# Altium project PCB_Project2.PrjPCB
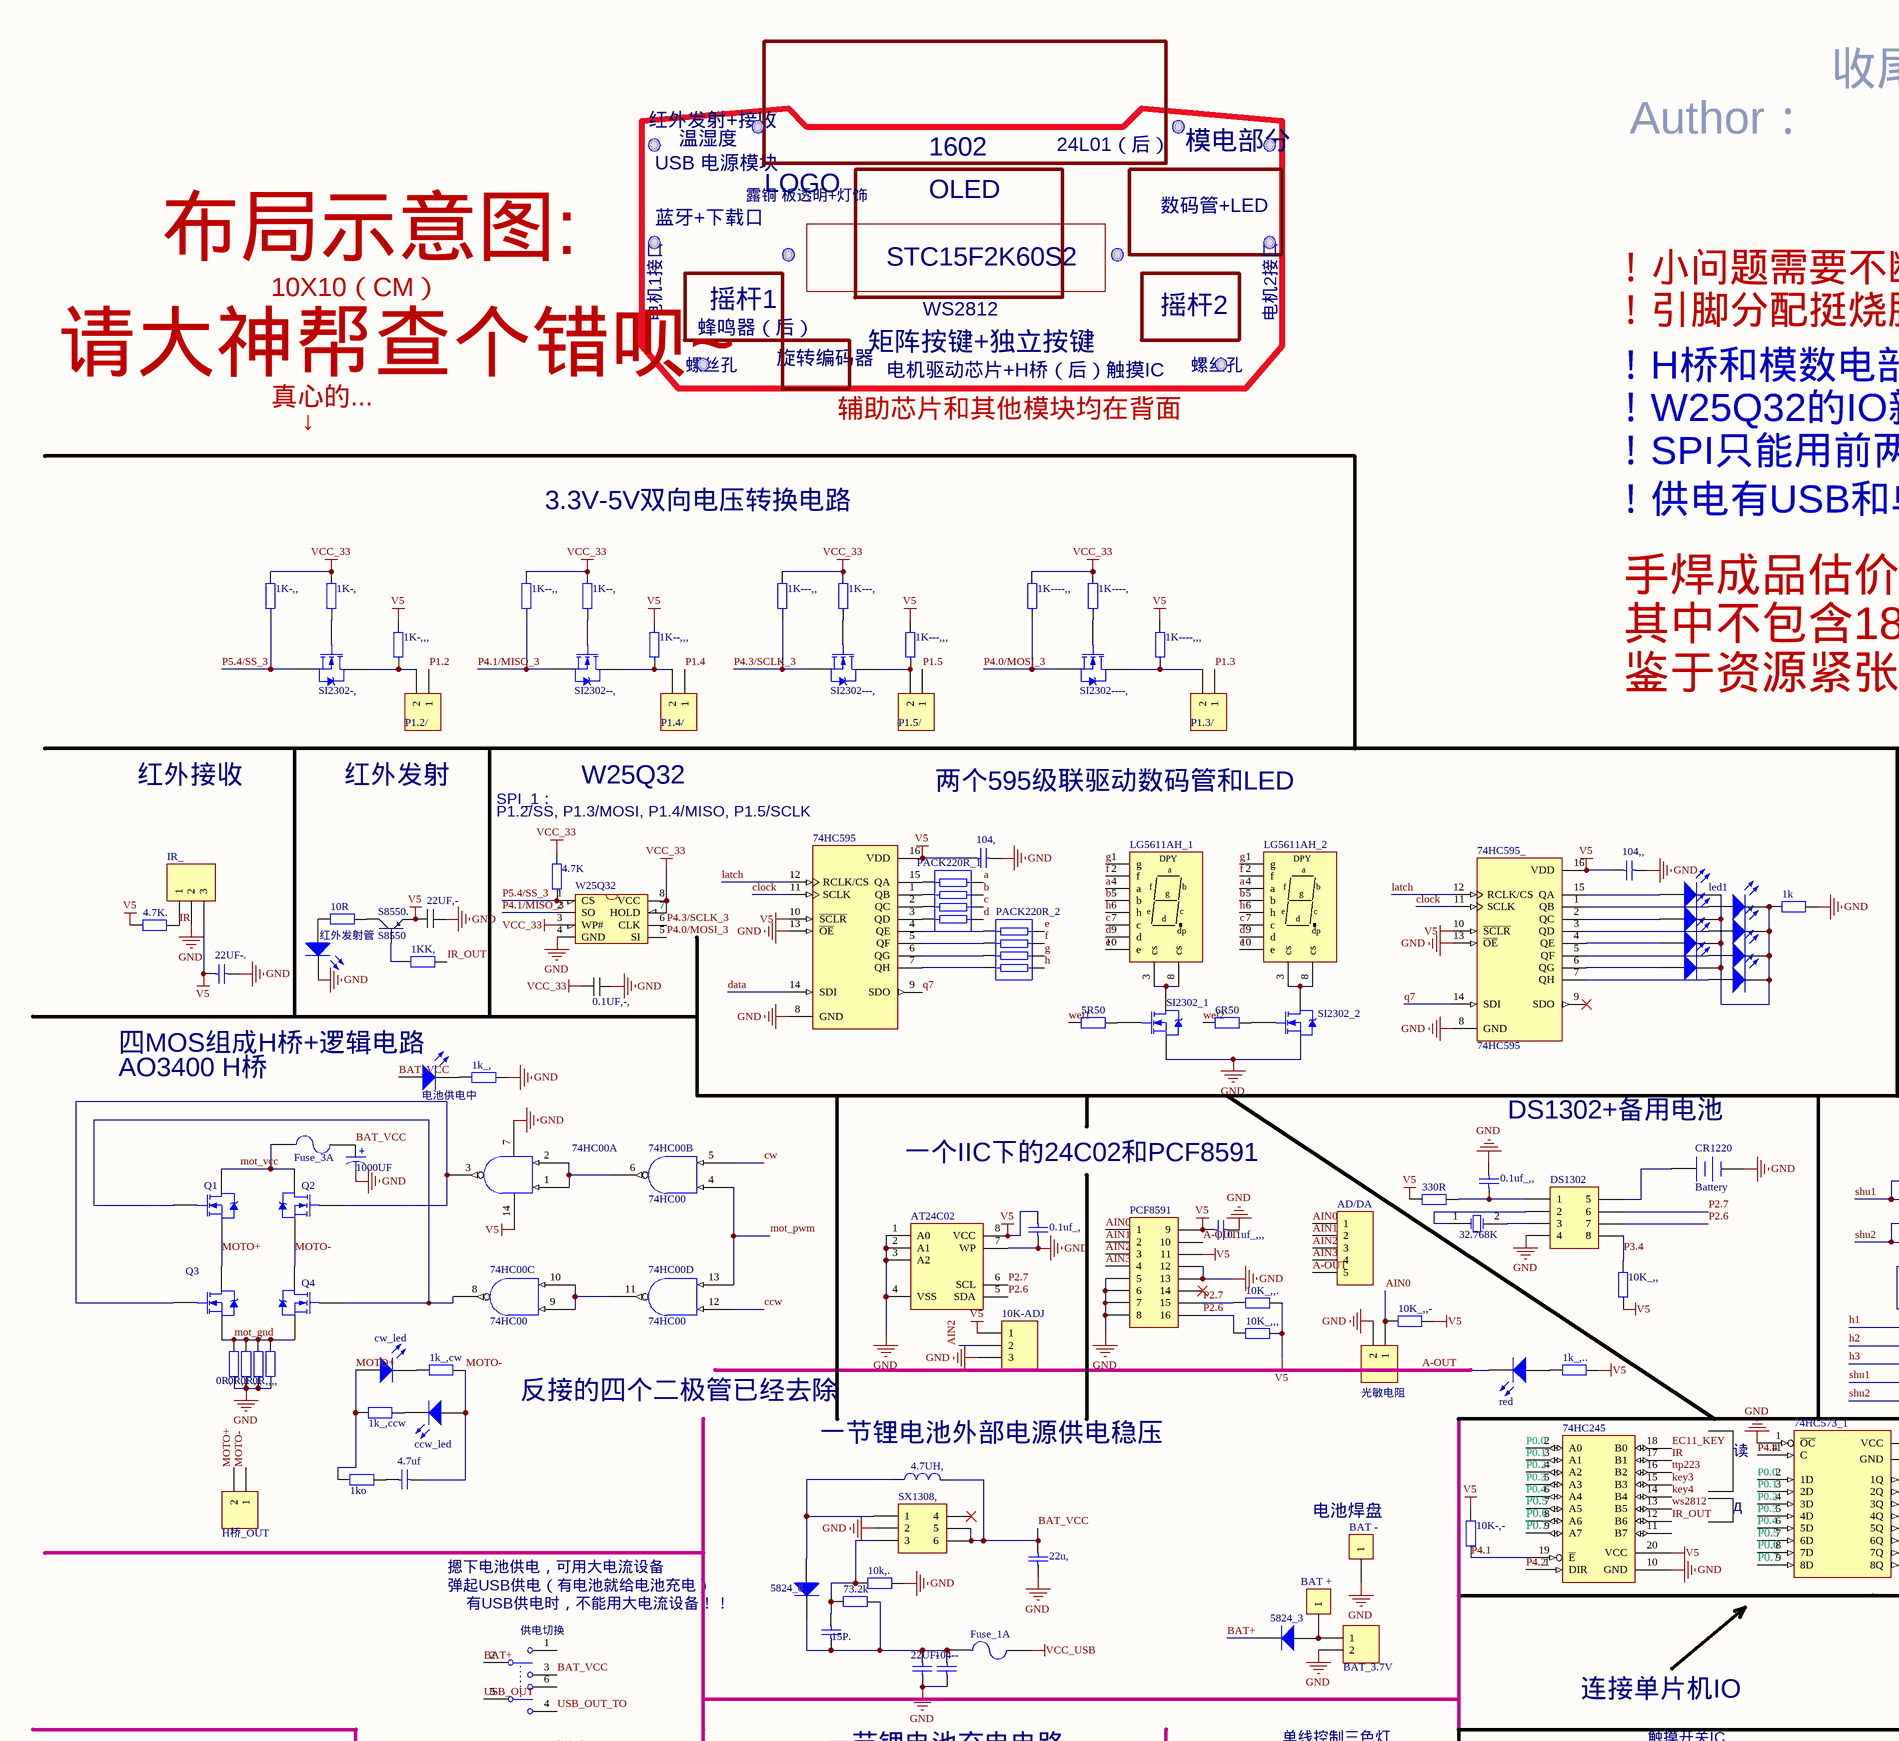
[diagram p0: Sheet1.SchDoc, top left]
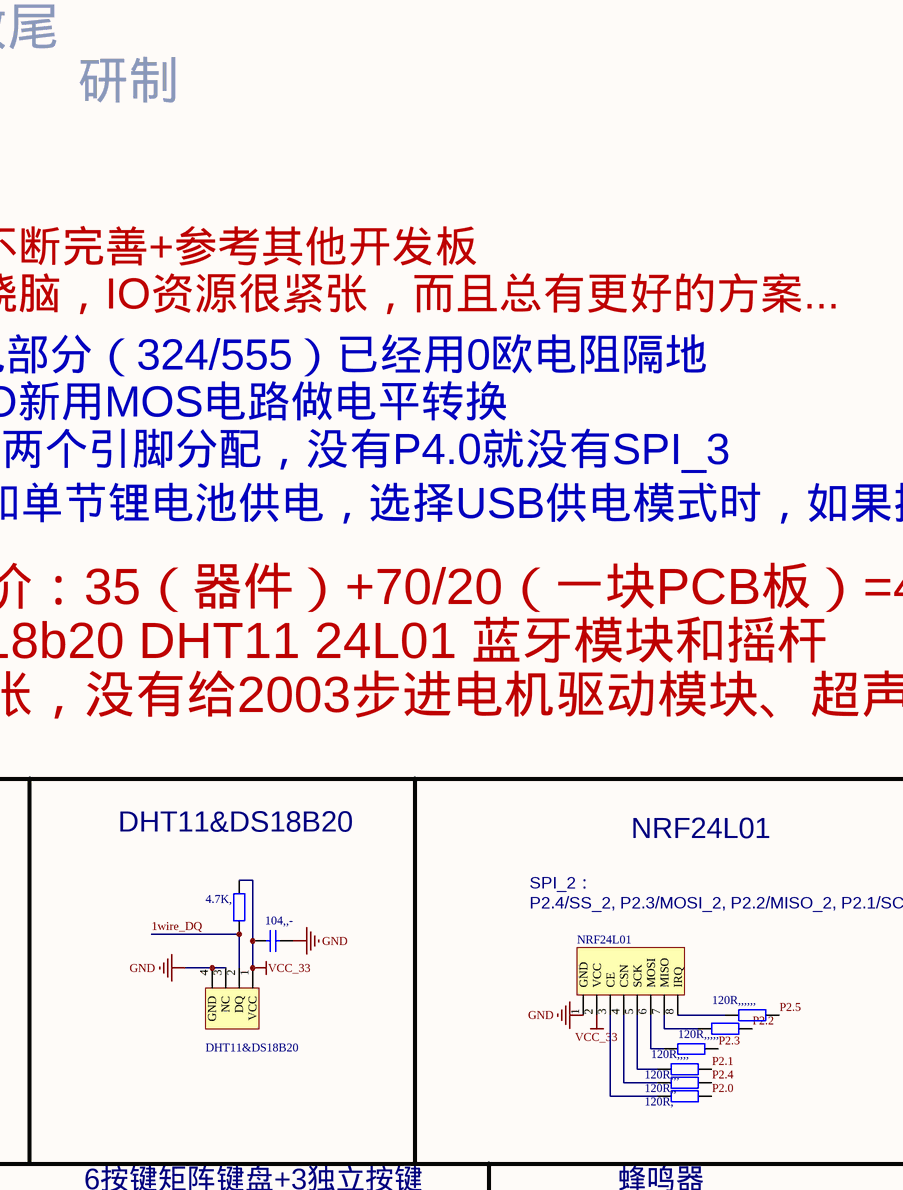
[diagram p1: Sheet1.SchDoc, top middle]
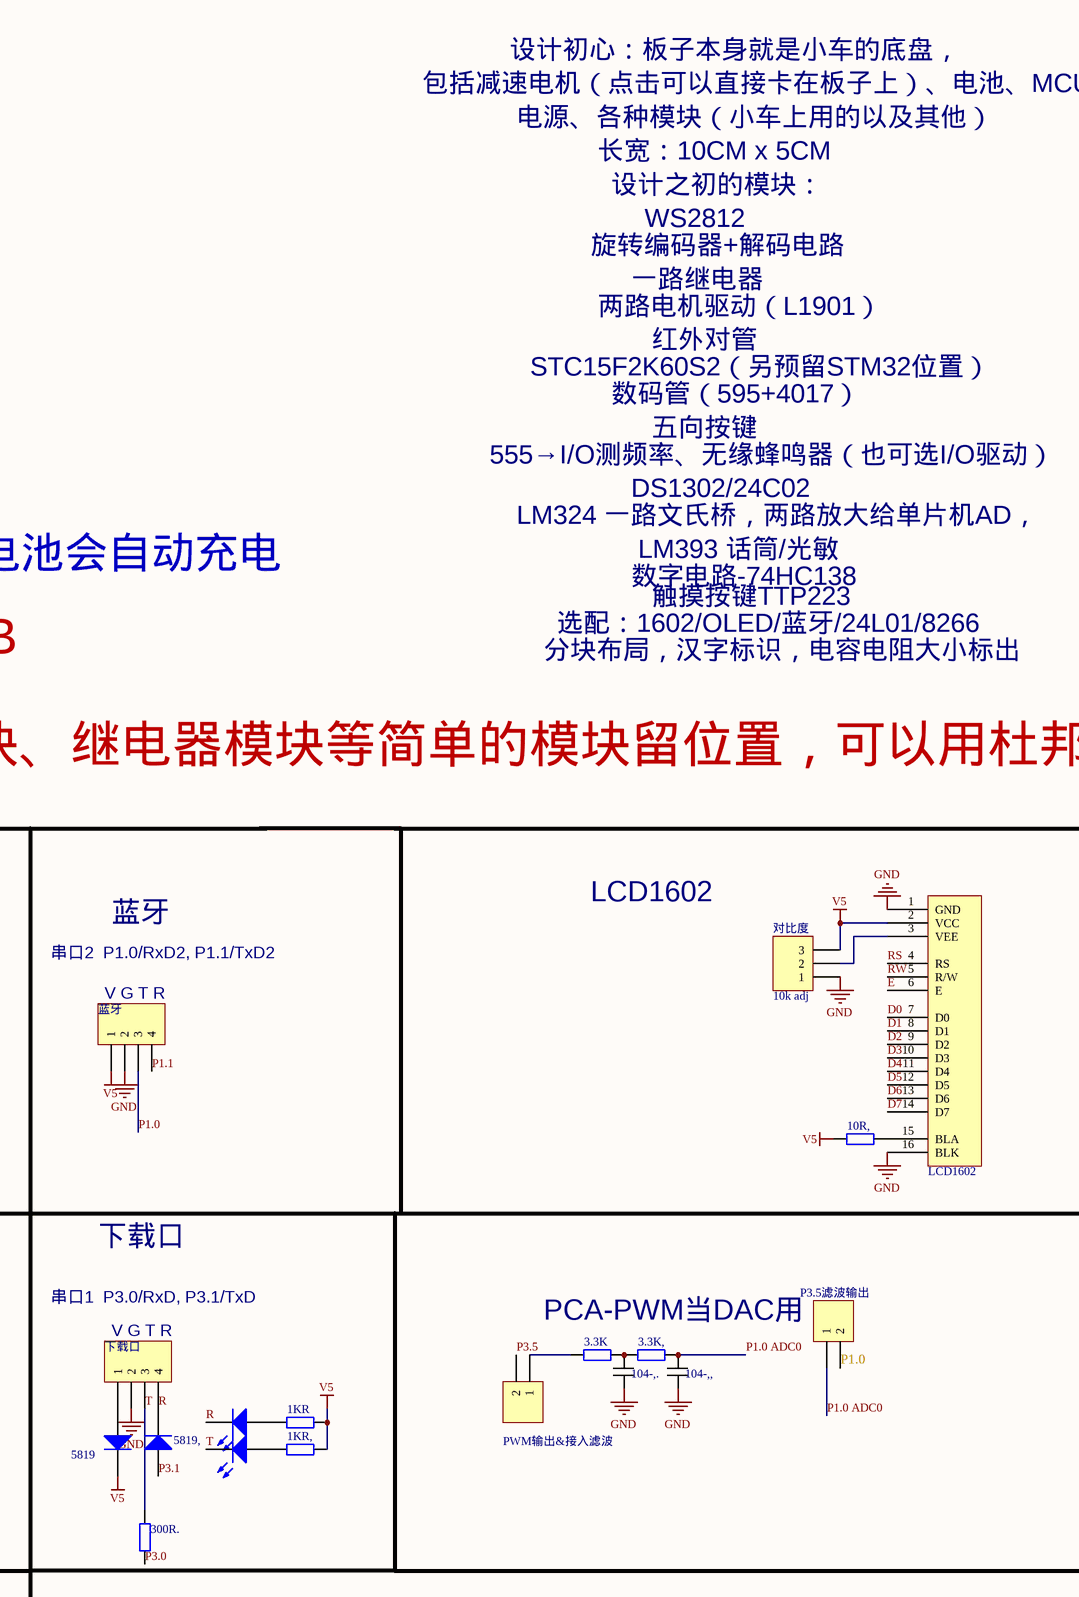
[diagram p2: Sheet1.SchDoc, top right]
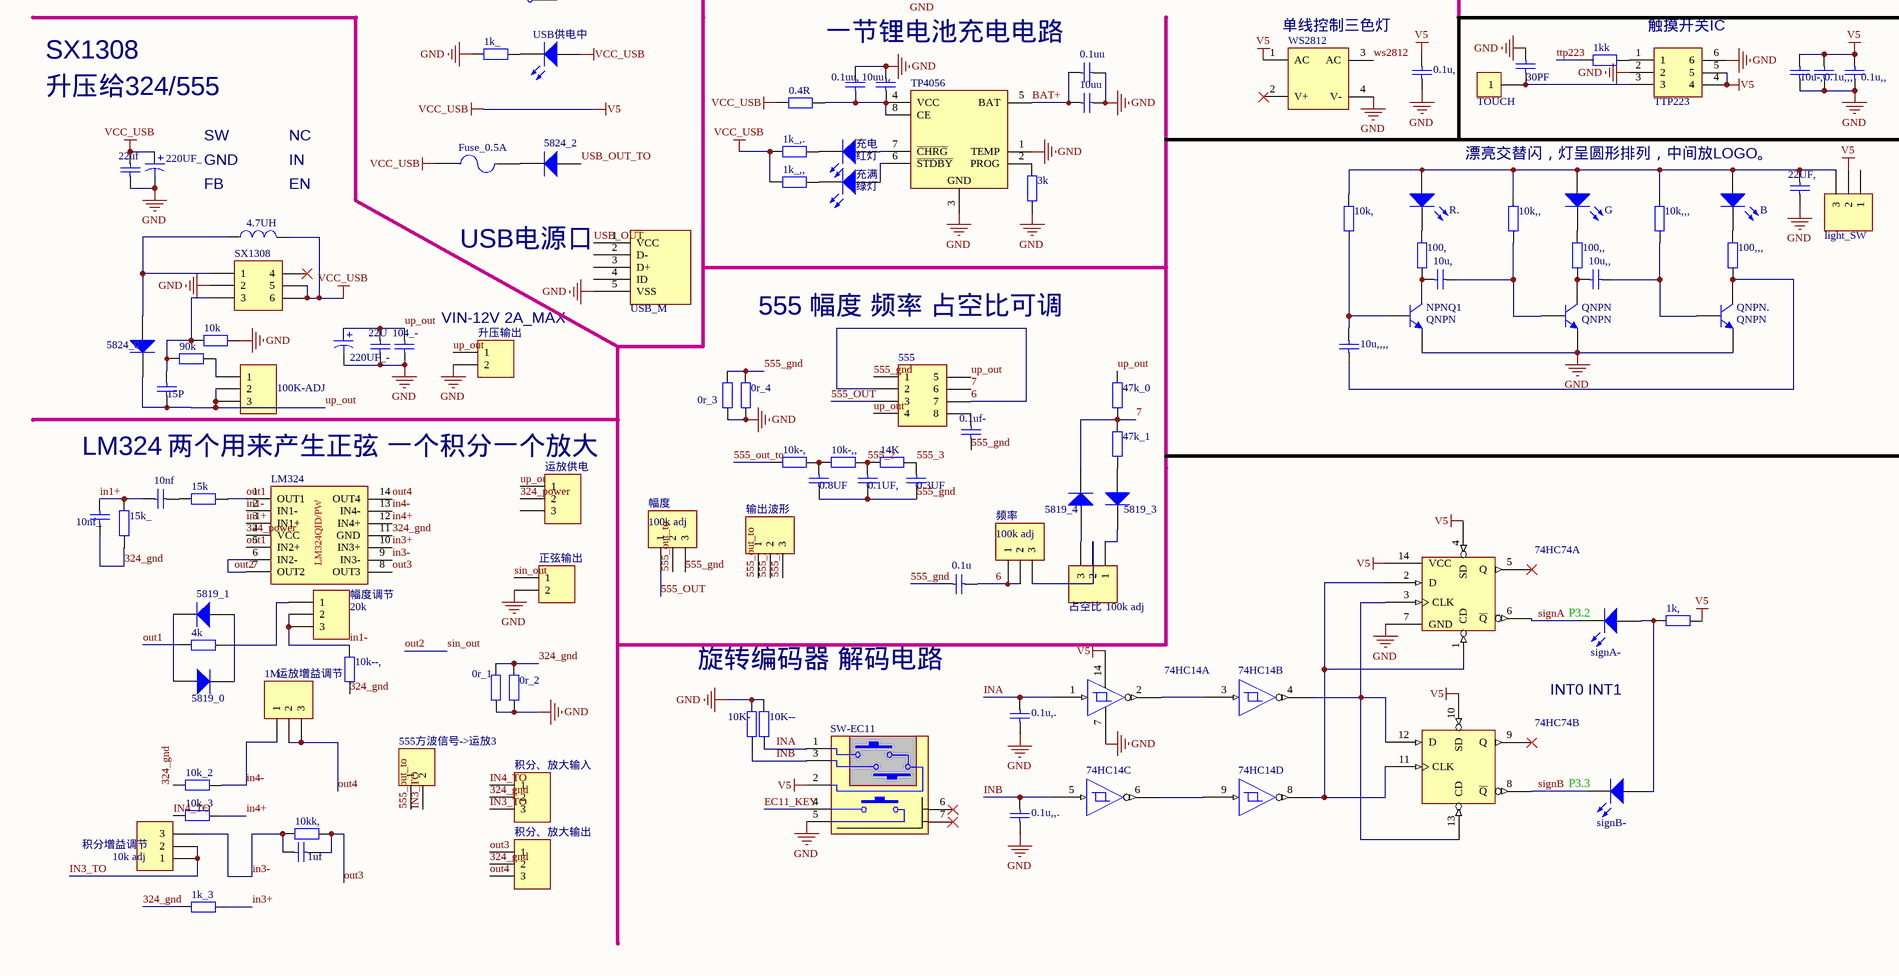
[diagram p3: Sheet1.SchDoc, bottom left]
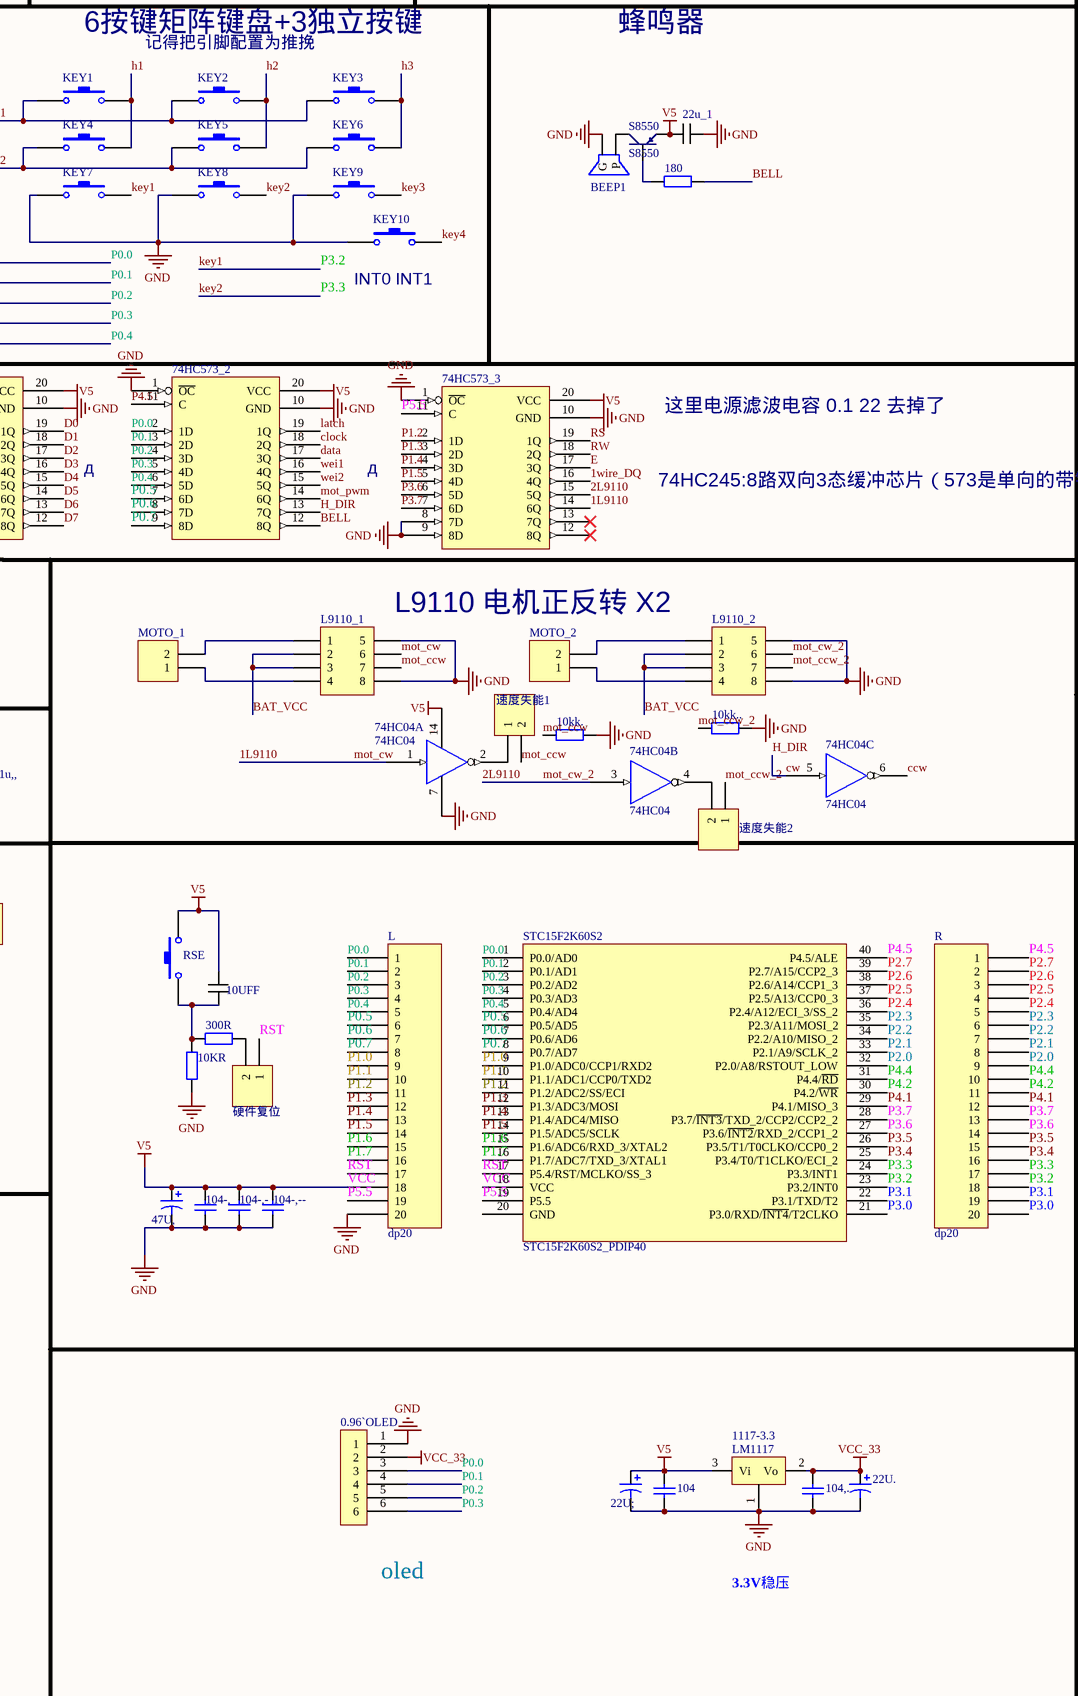
[diagram p4: Sheet1.SchDoc, bottom middle]
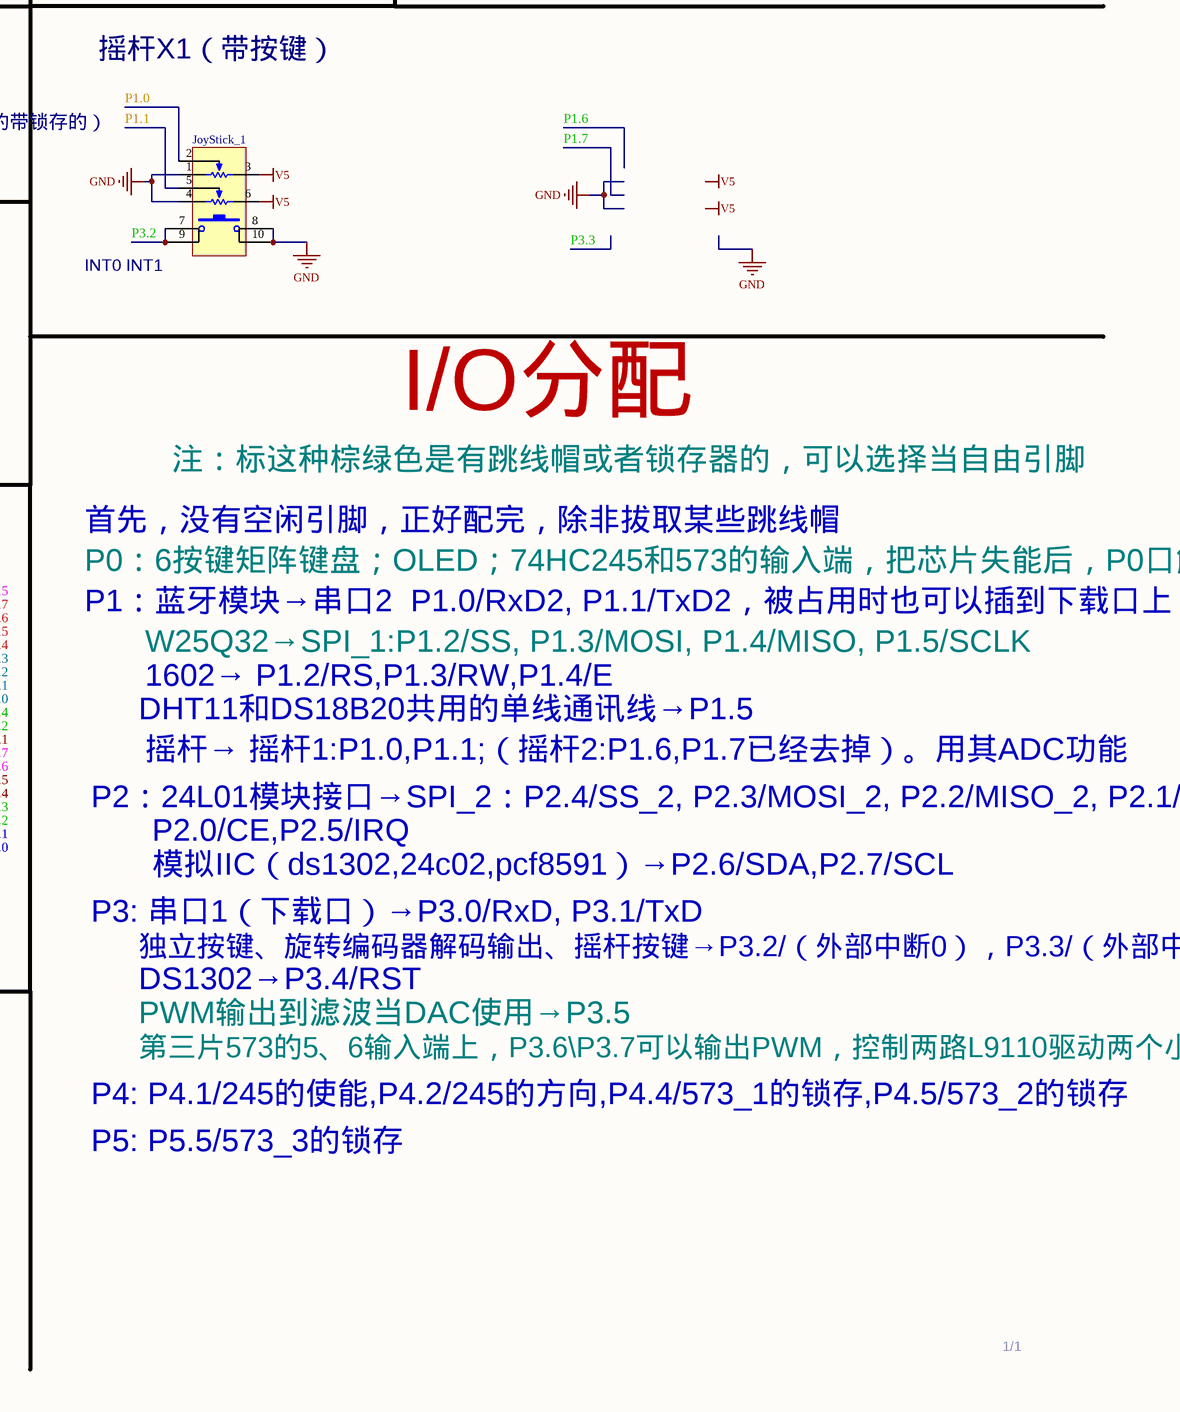
[diagram p5: Sheet1.SchDoc, bottom right]
1 sheet, 288 parts. Net scope: global (net labels, ports and power ports of the same name join across sheets).
Board file: PCB1.PcbDoc

## Sheet Sheet1.SchDoc: STC15开发板（寓教于乐多功能游戏把）
size A1; Author: @Staok; DrawnBy: 许皓阳; Revision: 3.14

### Parts
0  LED0  [LED_0805]  (value not drawn)
0.1u  Cap  [0805_C]  (value not drawn)
0.1u,  11  [C-RAD-0805]  (value not drawn)
0.1u,,  11  [C-RAD-0805]  (value not drawn)
0.1u,,,  11  [C-RAD-0805]  (value not drawn)
0.1u,,.  Cap  [0805_C]  (value not drawn)
0.1u,.  Cap  [0805_C]  (value not drawn)
0.1UF,  Cap  [0805_C]  (value not drawn)
0.1UF,-,  (no value)  [0805 - duplicate]
0.1uf-  Cap  [0805_C]  (value not drawn)
0.1uf_,  Cap  [0805_C]  (value not drawn)
0.1uf_,,  Cap  [0805_C]  (value not drawn)
0.1uf_,,,  Cap  [0805_C]  (value not drawn)
0.1uu  Cap  [0805_C]  (value not drawn)
0.1uu,  Cap  [0805_C]  (value not drawn)
0.3UF  Cap  [0805_C]  (value not drawn)
0.4R  Res2  [RES 0805_1]  (value not drawn)
0.8UF  Cap  [0805_C]  (value not drawn)
0.96`OLED  S6  [HDR1X6]  (value not drawn)
0R,  Res2  [0805-1]  (value not drawn)
0R,,  Res2  [0805-1]  (value not drawn)
0R,,,  Res2  [0805-1]  (value not drawn)
0R,,,,  Res2  [0805-1]  (value not drawn)
0r_1  Res2  [RES 0805_1]  (value not drawn)
0r_2  Res2  [RES 0805_1]  (value not drawn)
0r_3  Res2  [RES 0805_1]  (value not drawn)
0r_4  Res2  [RES 0805_1]  (value not drawn)
1  LED0  [LED_0805]  (value not drawn)
1k  Res1  [0805-2]  (value not drawn)
1k,  Res2  [RES 0805_1]  (value not drawn)
1K-,  Res2  [0805 - duplicate]  (value not drawn)
1K-,,  Res2  [0805 - duplicate]  (value not drawn)
1K-,,,  Res2  [0805 - duplicate]  (value not drawn)
1K--,  Res2  [0805 - duplicate]  (value not drawn)
1K--,,  Res2  [0805 - duplicate]  (value not drawn)
1K--,,,  Res2  [0805 - duplicate]  (value not drawn)
1K---,  Res2  [0805 - duplicate]  (value not drawn)
1K---,,  Res2  [0805 - duplicate]  (value not drawn)
1K---,,,  Res2  [0805 - duplicate]  (value not drawn)
1K----,  Res2  [0805 - duplicate]  (value not drawn)
1K----,,  Res2  [0805 - duplicate]  (value not drawn)
1K----,,,  Res2  [0805 - duplicate]  (value not drawn)
1k_  Res2  [0805-1]  (value not drawn)
1k_3  Res2  [RES 0805_1]  (value not drawn)
1k_,  Res2  [0805-1]  (value not drawn)
1k_,,  Res2  [0805-1]  (value not drawn)
1k_,.  Res2  [0805-1]  (value not drawn)
1k_,..  R2  [0805]  (value not drawn)
1k_,ccw  Res2  [0805-1]  (value not drawn)
1k_,cw  Res2  [0805-1]  (value not drawn)
1kk  Res2  [RES 0805_1]  (value not drawn)
1KK,  Res2  [0805 - duplicate]  (value not drawn)
1ko  Res2  [0805-1]  (value not drawn)
1KR  Res2  [0805 - duplicate]  (value not drawn)
1KR,  Res2  [0805 - duplicate]  (value not drawn)
1uf  Cap  [0805_C]  (value not drawn)
3.3K  Res2  [0805 - duplicate]  (value not drawn)
3.3K,  Res2  [0805 - duplicate]  (value not drawn)
3k  Res2  [RES 0805_1]  (value not drawn)
4.7K  Res2  [0805 - duplicate]  (value not drawn)
4.7K,  Res1  [0805-2]  (value not drawn)
4.7K.  Res2  [0805-1]  (value not drawn)
4.7uf  Cap  [0805_C]  (value not drawn)
4.7UH  Inductor  [L-SMD-10]  (value not drawn)
4.7UH,  Inductor  [L-SMD-10]  (value not drawn)
4k  Res2  [RES 0805_1]  (value not drawn)
5R50  R2  [0805]  (value not drawn)
6R50  R2  [0805]  (value not drawn)
10k  Res2  [RES 0805_1]  (value not drawn)
10k,  Res2  [RES 0805_1]  (value not drawn)
10k,,  Res2  [RES 0805_1]  (value not drawn)
10k,,,  Res2  [RES 0805_1]  (value not drawn)
10k,.  Res2  [RES 0805_1]  (value not drawn)
10K-  Res2  [RES 0805_1]  (value not drawn)
10k-,  Res2  [RES 0805_1]  (value not drawn)
10k-,,  Res2  [RES 0805_1]  (value not drawn)
10K-,-  R2  [0805]  (value not drawn)
10K--  Res2  [RES 0805_1]  (value not drawn)
10k--,  Res2  [RES 0805_1]  (value not drawn)
10K-ADJ  MHDR1X3  [pot（正方形）]  (value not drawn)
10k_2  Res2  [RES 0805_1]  (value not drawn)
10k_3  Res2  [RES 0805_1]  (value not drawn)
10K_,,  R2  [0805]  (value not drawn)
10K_,,,  R2  [0805]  (value not drawn)
10K_,,-  R2  [0805]  (value not drawn)
10K_,,.  R2  [0805]  (value not drawn)
10kk,  Res2  [RES 0805_1]  (value not drawn)
10kk.  Res2  [0805 - duplicate]  (value not drawn)
10kk..  Res2  [0805 - duplicate]  (value not drawn)
10KR  Res2  [0805 - duplicate]  (value not drawn)
10nf  Cap  [0805_C]  (value not drawn)
10nf_  Cap  [0805_C]  (value not drawn)
10R  Res2  [0805 - duplicate]  (value not drawn)
10R,  Res2  [0805 - duplicate]  (value not drawn)
10u,  Cap  [0805_C]  (value not drawn)
10u,,  Cap  [0805_C]  (value not drawn)
10u,,,,  Cap  [0805_C]  (value not drawn)
10u-,  11  [C-RAD-0805]  (value not drawn)
10UFF  (no value)  [0805 - duplicate]
10uu  Cap  [0805_C]  (value not drawn)
10uu，  Cap  [0805_C]  (value not drawn)
14K  Res2  [RES 0805_1]  (value not drawn)
15k  Res2  [RES 0805_1]  (value not drawn)
15k_  Res2  [RES 0805_1]  (value not drawn)
15P  Cap  [0805_C]  (value not drawn)
15P.  Cap  [0805_C]  (value not drawn)
22U  Cap  [0805_C]  (value not drawn)
22u,  Cap  [0805_C]  (value not drawn)
22U.  Cap Pol1  [0805]  (value not drawn)
22U;  Cap Pol1  [0805]  (value not drawn)
22u_1  (no value)  [0805 - duplicate]
22uf  Cap  [0805_C]  (value not drawn)
22UF,  Cap  [0805_C]  (value not drawn)
22UF,-  (no value)  [0805 - duplicate]
22UF-  Cap  [0805_C]  (value not drawn)
22UF-.  Cap  [0805_C]  (value not drawn)
30pf  value 30PF  [C-RAD-0805]  (hidden comment: Cap)
32.768K  32.768K  [XTAL32]  (value not drawn)
47k_0  Res2  [RES 0805_1]  (value not drawn)
47k_1  Res2  [RES 0805_1]  (value not drawn)
47U,  Cap Pol1  [1210]  (value not drawn)
73.2k  Res2  [RES 0805_1]  (value not drawn)
74HC00  74HC00  [SOP-14P]  (value not drawn)  (parts A,B,C,D of 4)
74HC04  74HC04  [SOP-14P]  (parts A,B,C of 6)
74HC14  74HC14  [SOP-14P]  (value not drawn)  (parts A,B,C,D of 6)
74HC74  74HC74  [SOP-14P]  (value not drawn)  (parts A,B of 2)
74HC245  74HC245  [SOP20]  (value not drawn)
74HC573_1  74HC573  [SOP20]  (value not drawn)
74HC573_2  74HC573  [SOP20]  (value not drawn)
74HC573_3  74HC573  [SOP20]  (value not drawn)
74HC595  74HC595  [NSO16_M]  (value not drawn)
74HC595_  74HC595  [NSO16_M]
90k  Res2  [RES 0805_1]  (value not drawn)
100,  Res2  [RES 0805_1]  (value not drawn)
100,,  Res2  [RES 0805_1]  (value not drawn)
100,,,  Res2  [RES 0805_1]  (value not drawn)
100K-ADJ  MHDR1X3  [pot（正方形）]  (value not drawn)
104  104  [0805]  (value not drawn)
104,  Cap  [0805_C]  (value not drawn)
104,,  Cap  [0805_C]  (value not drawn)
104,,-  Cap  [0805_C]  (value not drawn)
104,.  105  [0805]  (value not drawn)
104-,  104  [0805]  (value not drawn)
104-,,  (no value)  [0805 - duplicate]
104-,-  104  [0805]  (value not drawn)
104-,--  104  [0805]  (value not drawn)
104-,.  (no value)  [0805 - duplicate]
104--  Cap  [0805_C]  (value not drawn)
104_-  Cap  [0805_C]  (value not drawn)
120R,  Res1  [0805-2]  (value not drawn)
120R,,  Res1  [0805-2]  (value not drawn)
120R,,,  Res1  [0805-2]  (value not drawn)
120R,,,,  Res1  [0805-2]  (value not drawn)
120R,,,,,  Res1  [0805-2]  (value not drawn)
120R,,,,,,  Res1  [0805-2]  (value not drawn)
180  Res2  [0805 - duplicate]  (value not drawn)
220UF_  Cap Pol1  [capso_8*10]  (value not drawn)
220UF_-  Cap Pol1  [capso_8*10]  (value not drawn)
300R  Res2  [0805 - duplicate]  (value not drawn)
300R.  Res2  [0805 - duplicate]  (value not drawn)
330R  R2  [0805]  (value not drawn)
555  Header 4X2A  [SOP8]  (value not drawn)
555方波信号->运放3  Header 2  [HDR1X2]  (value not drawn)
1000UF  Cap Pol1  [CAPSO_10*10]  (value not drawn)
1117-3.3  LM1117  [SOT223]  (value not drawn)
5819  1N5819  [LED_0805]  (value not drawn)
5819,  1N5819  [LED_0805]  (value not drawn)
5819_0  1N5819  [LED_0805]  (value not drawn)
5819_1  1N5819  [LED_0805]  (value not drawn)
5819_3  1N5819  [LED_0805]  (value not drawn)
5819_4  1N5819  [LED_0805]  (value not drawn)
5824_0  1N5819  [DIODE-SMA]  (value not drawn)
5824_0,  1N5819  [DIODE-SMA]  (value not drawn)
5824_2  1N5819  [DIODE-SMA]  (value not drawn)
5824_3  1N5819  [DIODE-SMA]  (value not drawn)
AD/DA  Header 5  [HDR1X5]  (value not drawn)
AT24C02  AT24C02  [SOIC8_N]  (value not drawn)
B  LED0  [LED_0805]  (value not drawn)
BAT_3.7V  Header 2  [HDR2X1_A]  (value not drawn)
BAT_+  CON1  [TP6]  (value not drawn)
BAT_-  CON1  [TP6]  (value not drawn)
BEEP1  BEEP  [BELL-5]  (value not drawn)
ccw_led  LED0  [LED_0805]  (value not drawn)
CR1220  Battery  [CR1220]
cw_led  LED0  [LED_0805]  (value not drawn)
DHT11&DS18B20  DHT11&DS18B20  [DHT11]  (value not drawn)
DS1302  Header 4X2A  [SOP8]  (value not drawn)
Fuse_0.5A  Fuse  [1206]  (value not drawn)
Fuse_1A  Fuse  [1206]  (value not drawn)
Fuse_3A  Fuse  [FUSE_V]  (value not drawn)
G  LED0  [LED_0805]  (value not drawn)
H桥_OUT  Header 2  [ED120/2DS_1]  (value not drawn)
IR_  Header 3  [HS0038B]  (value not drawn)
JoyStick_1  JoyStick  [JoyStick]  (value not drawn)
KEY1  SW-PB  [SW_PB2_A1]  (value not drawn)
KEY2  SW-PB  [SW_PB2_A1]  (value not drawn)
KEY3  SW-PB  [SW_PB2_A1]  (value not drawn)
KEY4  SW-PB  [SW_PB2_A1]  (value not drawn)
KEY5  SW-PB  [SW_PB2_A1]  (value not drawn)
KEY6  SW-PB  [SW_PB2_A1]  (value not drawn)
KEY7  SW-PB  [SW_PB2_A1]  (value not drawn)
KEY8  SW-PB  [SW_PB2_A1]  (value not drawn)
KEY9  SW-PB  [SW_PB2_A1]  (value not drawn)
KEY10  SW-PB  [SW_PB2_A1]  (value not drawn)
L  dp20  [HDR1X20]
L9110_1  Header 4X2A  [SOP8]  (value not drawn)
L9110_2  Header 4X2A  [SOP8]  (value not drawn)
LCD1602  1602  [LCD1602A]  (value not drawn)
led1  LED0  [LED_0805]  (value not drawn)
led2  LED0  [LED_0805]  (value not drawn)
led3  LED0  [LED_0805]  (value not drawn)
led4  LED0  [LED_0805]  (value not drawn)
led5  LED0  [LED_0805]  (value not drawn)
led6  LED0  [LED_0805]  (value not drawn)
led7  LED0  [LED_0805]  (value not drawn)
led8  LED0  [LED_0805]  (value not drawn)
LG5611AH_1  LG5611AH  [LG5611AH]  (value not drawn)
LG5611AH_2  LG5611AH  [LG5611AH]  (value not drawn)
light_SW  MHDR1X3  [MHDR1X3]  (value not drawn)
LM324  LM324QID/PW  [SOP-14P]  (value not drawn)
MOTO_1  Header 2  [ED120/2DS_1]  (value not drawn)
MOTO_2  Header 2  [ED120/2DS_1]  (value not drawn)
NPNQ1  QNPN  [SOT-23B_N]
NRF24L01  NRF24L01  [NRF24L01]  (value not drawn)
P1.2/  Header 2  [HDR2X1_A]  (value not drawn)
P1.3/  Header 2  [HDR2X1_A]  (value not drawn)
P1.4/  Header 2  [HDR2X1_A]  (value not drawn)
P1.5/  Header 2  [HDR2X1_A]  (value not drawn)
P3.5滤波输出  Header 2  [HDR2X1_A]  (value not drawn)
PACK220R_1  RESPACK4  [RESPACK4_SMD]  (value not drawn)
PACK220R_2  RESPACK4  [RESPACK4_SMD]  (value not drawn)
PCF8591  Header 8X2A  [SOP16-50-208]  (value not drawn)
PWM输出&接入滤波  Header 2  [HDR2X1_A]  (value not drawn)
Q1  LR7843  [SOT-23N]  (value not drawn)
Q2  LR7843  [SOT-23N]  (value not drawn)
Q3  LR7843  [SOT-23N]  (value not drawn)
Q4  LR7843  [SOT-23N]  (value not drawn)
QNPN  QNPN  [SOT-23B_N]
QNPN.  QNPN  [SOT-23B_N]
R  dp20  [HDR1X20]
R.  LED0  [LED_0805]  (value not drawn)
red  LED0  [LED_0805]  (value not drawn)
RSE  SW-PB  [SW_PB2_A1]  (value not drawn)
S8550  S8550  [SOT-23R]
S8550.  S8550  [SOT-23R]
SI2302-,  LR7843  [SOT-23N]  (value not drawn)
SI2302--,  LR7843  [SOT-23N]  (value not drawn)
SI2302---,  LR7843  [SOT-23N]  (value not drawn)
SI2302----,  LR7843  [SOT-23N]  (value not drawn)
SI2302_1  LR7843  [SOT-23N]  (value not drawn)
SI2302_2  LR7843  [SOT-23N]  (value not drawn)
signA-  LED0  [LED_0805]  (value not drawn)
signB-  LED0  [LED_0805]  (value not drawn)
STC15F2K60S2  STC15F2K60S2_PDIP40  [DIP40]
SW-EC11  SW-EC11  [EC11]  (value not drawn)
SX1308  Header 3X2A  [SOT23-6]  (value not drawn)
SX1308,  Header 3X2A  [SOT23-6]  (value not drawn)
TOUCH  CON1  [TP-1.5]  (value not drawn)
TP4056  TP4056  [NSO8_TP4056]  (value not drawn)
ttp1  TTP223  [SOT23-6]
USB_M  USB_M  [USB_MICRO]  (value not drawn)
USB供电中  LED0  [LED_0805]  (value not drawn)
W25Q32  W25Q32  [SOIC-8]  (value not drawn)
WS2812  2812  [WS2812]  (value not drawn)
下载口  Header 4  [HDR1X4]  (value not drawn)
供电切换  SW-DPDT  [SWITCH_B1]  (value not drawn)
充满  绿灯  [LED_0805]
充电  红灯  [LED_0805]
光敏电阻  Header 2  [HDR2X1_A]  (value not drawn)
升压输出  Header 2  [HDR1X2]  (value not drawn)
占空比  100k adj  [pot（正方形）]
对比度  10k adj  [pot（正方形）]
幅度  100k adj  [pot（正方形）]
幅度调节  20k  [pot（正方形）]
正弦输出  Header 2  [HDR1X2]  (value not drawn)
电池供电中  LED0  [LED_0805]  (value not drawn)
硬件复位  Header 2  [HDR2X1_A]  (value not drawn)
积分、放大输入  Header 3  [HDR1X3]  (value not drawn)
积分、放大输出  Header 3  [HDR1X3]  (value not drawn)
积分增益调节  10k adj  [pot（正方形）]
红外发射管  LED0  [LED_A1]  (value not drawn)
蓝牙  Header 4  [HDR1X4]  (value not drawn)
输出波形  Header 3  [HDR1X3]  (value not drawn)
运放供电  MHDR1X3  [MHDR1X3]  (value not drawn)
运放增益调节  1M  [pot（正方形）]
速度失能1  Header 2  [HDR2X1_A]  (value not drawn)
速度失能2  Header 2  [HDR2X1_A]  (value not drawn)
频率  100k adj  [pot（正方形）]

### Nets
GND: 0.1u,.1 0.1u,,.1 0.1u,,,.1 0.1u,,..2 0.1u,..2 0.1UF,-,.2 0.1uf_,.1 0.1uf_,,.2 0.1uf_,,,.1 0.1uu.2 0.1uu,.2 0.96`OLED.1 0R,.2 0R,,.2 0R,,,.2 0R,,,,.2 0r_1.1 0r_2.1 0r_3.1 0r_4.1 1k.2 1k_.1 1k_,.1 3k.1 10k.2 10k,..2 10K-.2 10K--.2 10K-ADJ.3 10kk..1 10kk...1 10KR.2 10u-,.1 10uu.2 10uu，.2 22U.1 22u,.1 22U..2 22U;.2 22u_1.1 22uf.1 22UF,.1 22UF,-.1 22UF-.1 22UF-..1 30pf.2 47U,.2 74HC00.7(GND) 74HC04.7(GND) 74HC14.7(GND) 74HC74.7(GND) 74HC245.10(GND) 74HC573_1.1(~{OC}) 74HC573_1.10(GND) 74HC573_2.1(~{OC}) 74HC573_2.10(GND) 74HC573_3.1(~{OC}) 74HC573_3.8(7D) 74HC573_3.9(8D) 74HC573_3.10(GND) 74HC595.8(GND) 74HC595.13(~{OE}) 74HC595_.8(GND) 74HC595_.13(~{OE}) 104.2 104,.1 104,,.1 104,,-.1 104,..2 104-,.2 104-,,.2 104-,-.2 104-,--.2 104-,..2 104--.1 104_-.1 220UF_.2 220UF_-.2 1000UF.2 1117-3.3.1(COM) AT24C02.1(A0) AT24C02.2(A1) AT24C02.3(A2) AT24C02.4(VSS) AT24C02.7(WP) BAT_3.7V.2 BAT_-.1 BEEP1.2(G) CR1220.2(-) DHT11&DS18B20.3(NC) DHT11&DS18B20.4(GND) DS1302.4 IR_.2 JoyStick_1.1(BOT) JoyStick_1.4(BOT) JoyStick_1.8 JoyStick_1.10 KEY7.1 KEY8.1 KEY9.1 KEY10.1 L.20 L9110_1.5 L9110_1.8 L9110_2.5 L9110_2.8 LCD1602.1(GND) LCD1602.16(BLK) NPNQ1.3(E) NRF24L01.1(GND) PCF8591.5 PCF8591.6 PCF8591.7 PCF8591.8 PCF8591.12 PCF8591.13 QNPN.3(E) QNPN..3(E) SI2302_1.3(S) SI2302_2.3(S) SW-EC11.5 SX1308.2 SX1308,.2 TP4056.1(TEMP) TP4056.3(GND) ttp1.2 ttp1.6 USB_M.5(VSS) W25Q32.4(GND) WS2812.4(V-) 下载口.2 光敏电阻.2 升压输出.2 对比度.1 正弦输出.2 红外发射管.2(K) 蓝牙.2
VCC: 0.1u,.2 0.1u,,.2 0.1u,,,.2 0.1uf_,.2 0.1uf_,,,.2 0.4R.2 1k,.2 1K-,,,.1 1K--,,,.1 1K---,,,.1 1K----,,,.1 1k_,,.1 1k_,..1 1k_,...2 1KR.1 1KR,.1 4.7K..2 4.7UH.2 10K-,-.2 10K-ADJ.1 10K_,,.1 10K_,,,.2 10K_,,-.2 10K_,,..2 10R,.2 10u-,.2 10UFF.1 22U;.1 22u_1.2 22uf.2 22UF,-.2 22UF-..2 47U,.1 74HC00.14(VCC) 74HC04.14(VCC) 74HC14.14(VCC) 74HC74.4(SD) 74HC74.10(SD) 74HC74.14(VCC) 74HC245.20(VCC) 74HC573_1.20(VCC) 74HC573_2.20(VCC) 74HC573_3.20(VCC) 74HC595.10(~{SCLR}) 74HC595.16(VDD) 74HC595_.10(~{SCLR}) 74HC595_.16(VDD) 104.1 104,.2 104,,.2 104-,.1 104-,-.1 104-,--.1 220UF_.1 330R.1 1117-3.3.3(Vi) 5819.2(K) AT24C02.8(VCC) Fuse_0.5A.1 Fuse_1A.2 IR_.3 JoyStick_1.3(TOP) JoyStick_1.6(TOP) L.18 LCD1602.2(VCC) light_SW.2 PCF8591.9 PCF8591.11 RSE.2 S8550.1(E) S8550..1(E) STC15F2K60S2.18(VCC) SW-EC11.2 SX1308.5 SX1308.6 ttp1.4 ttp1.5 USB供电中.1(A) WS2812.1(AC) 对比度.3 蓝牙.1  [also labelled V5, VCC_USB]
VCC_33: 0.1UF,-,.1 0.96`OLED.2 1K-,.1 1K-,,.1 1K--,.1 1K--,,.1 1K---,.1 1K---,,.1 1K----,.1 1K----,,.1 4.7K.2 4.7K,.2 22U..1 104,,-.2 104,..1 1117-3.3.2(Vo) DHT11&DS18B20.1(VCC) NRF24L01.2(VCC) W25Q32.3(WP#) W25Q32.7(HOLD) W25Q32.8(VCC)
1L9110: 74HC04.1 74HC573_3.14(6Q) L9110_1.6  [also labelled mot_cw]
1wire_DQ: 4.7K,.1 74HC573_3.16(4Q) DHT11&DS18B20.2(DQ)
2L9110: 74HC04.3 74HC573_3.15(5Q) L9110_2.6  [also labelled mot_cw_2]
6: 0.1u.1 555.2 555.7 频率.1 频率.2
7: 47k_0.2 47k_1.1 555.6 5819_4.2(K)
324_gnd: 0r_1.2 0r_2.2 1k_3.1 10k--,.1 10k_2.1 10nf_.1 15k_.1 LM324.11(GND) 积分、放大输入.2 积分、放大输出.2
324_power: LM324.4(VCC) 运放供电.2
555_2: 0.1UF,.2 10k-,,.1 14K.2 输出波形.2
555_3: 0.3UF.1 14K.1 输出波形.3
555_gnd: 0.1u.2 0.1UF,.1 0.1uf-.1 0.3UF.2 0.8UF.1 0r_3.2 0r_4.2 555.1 幅度.3
555_OUT: 555.3 幅度.1
555_out_to: 10k-,.2 555方波信号->运放3.1 幅度.2 输出波形.1
a: LG5611AH_1.4(a) LG5611AH_2.4(a) PACK220R_1.2
A-OUT: AD/DA.5 PCF8591.10 red.2(K)
AIN0: 10K_,,-.1 AD/DA.1 PCF8591.1 光敏电阻.1
AIN1: AD/DA.2 PCF8591.2
AIN2: 10K-ADJ.2 AD/DA.3 PCF8591.3
AIN3: AD/DA.4 PCF8591.4
b: LG5611AH_1.5(b) LG5611AH_2.5(b) PACK220R_1.4
BAT+: 0.1uu.1 10uu.1 5824_3.2(K) TP4056.5(BAT) 供电切换.2
BAT_VCC: 4.7UH,.2 22u,.2 1000UF.1 Fuse_3A.1 L9110_1.2 L9110_1.3 L9110_2.2 L9110_2.3 SX1308,.5 SX1308,.6 供电切换.3 电池供电中.1(A)
BELL: 74HC573_2.12(8Q) 180.2
c: LG5611AH_1.7(c) LG5611AH_2.7(c) PACK220R_1.6
ccw: 74HC00.12 74HC04.6
clock: 74HC573_2.18(2Q) 74HC595.11(SCLK) 74HC595_.11(SCLK)
cw: 74HC00.5 74HC04.5 74HC573_2.13(7Q)  [also labelled H_DIR]
d: LG5611AH_1.9(d) LG5611AH_2.9(d) PACK220R_1.8
D0: 74HC573_1.19(1Q) LCD1602.7(D0)
D1: 74HC573_1.18(2Q) LCD1602.8(D1)
D2: 74HC573_1.17(3Q) LCD1602.9(D2)
D3: 74HC573_1.16(4Q) LCD1602.10(D3)
D4: 74HC573_1.15(5Q) LCD1602.11(D4)
D5: 74HC573_1.14(6Q) LCD1602.12(D5)
D6: 74HC573_1.13(7Q) LCD1602.13(D6)
D7: 74HC573_1.12(8Q) LCD1602.14(D7)
data: 74HC573_2.17(3Q) 74HC595.14(SDI)
e: 74HC573_3.17(3Q) LCD1602.6(E) LG5611AH_1.10(e) LG5611AH_2.10(e) PACK220R_2.2
EC11_KEY: 74HC245.18(B0) SW-EC11.4
f: LG5611AH_1.2(f) LG5611AH_2.2(f) PACK220R_2.4
g: LG5611AH_1.1(g) LG5611AH_2.1(g) PACK220R_2.6
h: LG5611AH_1.6(h) LG5611AH_2.6(h) PACK220R_2.8
h1: 0.96`OLED.3 74HC245.2(A0) 74HC573_1.2(1D) 74HC573_2.2(1D) KEY1.2 KEY4.2 L.1 STC15F2K60S2.1(P0.0/AD0)  [also labelled P0.0]
h2: 0.96`OLED.4 74HC245.3(A1) 74HC573_1.3(2D) 74HC573_2.3(2D) KEY2.2 KEY5.2 L.2 STC15F2K60S2.2(P0.1/AD1)  [also labelled P0.1]
h3: 0.96`OLED.5 74HC245.4(A2) 74HC573_1.4(3D) 74HC573_2.4(3D) KEY3.2 KEY6.2 L.3 STC15F2K60S2.3(P0.2/AD2)  [also labelled P0.2]
in1+: 10nf.1 10nf_.2 15k_.2 LM324.3(IN1+)
in1-: 10k--,.2 LM324.2(IN1-) 幅度调节.2 幅度调节.3
in3+: 1k_3.2 LM324.10(IN3+)
in3-: 1uf.1 10kk,.1 LM324.9(IN3-) 积分增益调节.3
IN3_TO: 555方波信号->运放3.2 积分、放大输入.3 积分增益调节.1 积分增益调节.2
in4+: 10k_3.2 LM324.12(IN4+)
in4-: 10k_2.2 LM324.13(IN4-) 运放增益调节.1
IN4_TO: 10k_3.1 积分、放大输入.1
INA: 0.1u,..1 10K--.1 74HC14.1 SW-EC11.1
INB: 0.1u,,..1 10K-.1 74HC14.5 SW-EC11.3
IR: 4.7K..1 74HC245.17(B1) IR_.1
IR_OUT: 1KK,.2 74HC245.12(B6)
key1: 74HC74.6(~{Q}) JoyStick_1.7 JoyStick_1.9 KEY7.2 R.18 signA-.2(K) STC15F2K60S2.23(P3.2/INT0)  [also labelled P3.2, signA]
key2: 74HC74.8(~{Q}) KEY8.2 R.17 signB-.2(K) STC15F2K60S2.24(P3.3/INT1)  [also labelled P3.3, signB]
key3: 74HC245.15(B3) KEY9.2
key4: 74HC245.14(B4) KEY10.2
latch: 74HC573_2.19(1Q) 74HC595.12(RCLK/CS) 74HC595_.12(RCLK/CS)
mot_ccw: 10kk..2 L9110_1.7 速度失能1.2
mot_ccw_2: 10kk...2 L9110_2.7 速度失能2.1
mot_gnd: 0R,.1 0R,,.1 0R,,,.1 0R,,,,.1 Q3.3(S) Q4.3(S)
mot_pwm: 74HC00.4 74HC00.13 74HC573_2.14(6Q)
mot_vcc: Fuse_3A.2 Q1.2(D) Q2.2(D)
MOTO+: 1k_,ccw.1 1ko.1 cw_led.1(A) H桥_OUT.2 Q1.3(S) Q3.2(D)
MOTO-: 1k_,cw.1 4.7uf.1 ccw_led.1(A) H桥_OUT.1 Q2.3(S) Q4.2(D)
out1: 4k.1 15k.2 LM324.1(OUT1) LM324.5(IN2+)
out2: LM324.6(IN2-) LM324.7(OUT2) 正弦输出.1  [also labelled sin_out]
out3: 1uf.2 10kk,.2 LM324.8(OUT3) 积分、放大输出.1
out4: LM324.14(OUT4) 积分、放大输出.3 运放增益调节.2 运放增益调节.3
P0.3: 0.96`OLED.6 74HC245.5(A3) 74HC573_1.5(4D) 74HC573_2.5(4D) KEY1.1 KEY2.1 KEY3.1 L.4 STC15F2K60S2.4(P0.3/AD3)  [also labelled shu1]
P0.4: 74HC245.6(A4) 74HC573_1.6(5D) 74HC573_2.6(5D) KEY4.1 KEY5.1 KEY6.1 L.5 STC15F2K60S2.5(P0.4/AD4)  [also labelled shu2]
P0.5: 74HC245.7(A5) 74HC573_1.7(6D) 74HC573_2.7(6D) L.6 STC15F2K60S2.6(P0.5/AD5)
P0.6: 74HC245.8(A6) 74HC573_1.8(7D) 74HC573_2.8(7D) L.7 STC15F2K60S2.7(P0.6/AD6)
P0.7: 74HC245.9(A7) 74HC573_1.9(8D) 74HC573_2.9(8D) L.8 STC15F2K60S2.8(P0.7/AD7)
P1.0: JoyStick_1.2(TAP) L.9 P3.5滤波输出.2 STC15F2K60S2.9(P1.0/ADC0/CCP1/RXD2) 蓝牙.3
P1.0 ADC0: 3.3K,.2 104-,,.1 P3.5滤波输出.1
P1.1: JoyStick_1.5(TAP) L.10 STC15F2K60S2.10(P1.1/ADC1/CCP0/TXD2) 蓝牙.4
P1.2: 74HC573_3.2(1D) L.11 P1.2/.1 STC15F2K60S2.11(P1.2/ADC2/SS/ECI)
P1.3: 74HC573_3.3(2D) L.12 P1.3/.1 STC15F2K60S2.12(P1.3/ADC3/MOSI)
P1.4: 74HC573_3.4(3D) L.13 P1.4/.1 STC15F2K60S2.13(P1.4/ADC4/MISO)
P1.5: 74HC573_3.5(4D) L.14 P1.5/.1 STC15F2K60S2.14(P1.5/ADC5/SCLK)
P1.6: L.15 STC15F2K60S2.15(P1.6/ADC6/RXD_3/XTAL2)
P1.7: L.16 STC15F2K60S2.16(P1.7/ADC7/TXD_3/XTAL1)
P2.0: 120R,.2 R.9 STC15F2K60S2.32(P2.0/A8/RSTOUT_LOW)
P2.1: 120R,,,.2 R.8 STC15F2K60S2.33(P2.1/A9/SCLK_2)
P2.2: 120R,,,,,.2 R.7 STC15F2K60S2.34(P2.2/A10/MISO_2)
P2.3: 120R,,,,.2 R.6 STC15F2K60S2.35(P2.3/A11/MOSI_2)
P2.4: 120R,,.2 R.5 STC15F2K60S2.36(P2.4/A12/ECI_3/SS_2)
P2.5: 120R,,,,,,.2 R.4 STC15F2K60S2.37(P2.5/A13/CCP0_3)
P2.6: 10K_,,,.1 AT24C02.5(SDA) DS1302.7 PCF8591.16 R.3 STC15F2K60S2.38(P2.6/A14/CCP1_3)
P2.7: 10K_,,..1 AT24C02.6(SCL) DS1302.6 PCF8591.15 R.2 STC15F2K60S2.39(P2.7/A15/CCP2_3)
P3.0: 300R..1 R.20 STC15F2K60S2.21(P3.0/RXD/~{INT4}/T2CLKO)
P3.1: 5819,.1(A) R.19 STC15F2K60S2.22(P3.1/TXD/T2)
P3.4: 10K_,,.2 DS1302.8 R.16 STC15F2K60S2.25(P3.4/T0/T1CLKO/ECI_2)
P3.5: PWM输出&接入滤波.2 R.15 STC15F2K60S2.26(P3.5/T1/T0CLKO/CCP0_2)
P3.6: 74HC573_3.6(5D) R.14 STC15F2K60S2.27(P3.6/~{INT2}/RXD_2/CCP1_2)
P3.7: 74HC573_3.7(6D) R.13 STC15F2K60S2.28(P3.7/~{INT3}/TXD_2/CCP2/CCP2_2)
P4.0/MOSI_3: 1K----,,.2 SI2302----,.3(S) W25Q32.5(SI)
P4.1: 10K-,-.1 74HC245.19(~{E}) R.12 STC15F2K60S2.29(P4.1/MISO_3)
P4.1/MISO_3: 1K--,,.2 SI2302--,.3(S) W25Q32.2(SO)
P4.2: 74HC245.1(DIR) R.11 STC15F2K60S2.30(P4.2/~{WR})
P4.3/SCLK_3: 1K---,,.2 SI2302---,.3(S) W25Q32.6(CLK)
P4.4: 74HC573_1.11(C) R.10 STC15F2K60S2.31(P4.4/~{RD})
P4.5: 74HC573_2.11(C) R.1 STC15F2K60S2.40(P4.5/ALE)
P5.4/SS_3: 1K-,,.2 4.7K.1 SI2302-,.3(S) W25Q32.1(CS)
P5.5: 74HC573_3.11(C) L.19 STC15F2K60S2.19(P5.5)
q7: 74HC595.9(SDO) 74HC595_.14(SDI)
R: 0.2(K) 5819,.2(K) 下载口.4
RS: 74HC573_3.19(1Q) LCD1602.4(RS)
RST: L.17 STC15F2K60S2.17(P5.4/RST/MCLKO/SS_3) 硬件复位.1
RW: 74HC573_3.18(2Q) LCD1602.5(R/W)
T: 1.2(K) 300R..2 下载口.3
ttp223: 1kk.1 74HC245.16(B2)
up_out: 15P.2 22U.2 47k_0.1 100K-ADJ.2 100K-ADJ.3 104_-.2 220UF_-.1 555.4 555.5 5824_0.2(K) 升压输出.1 运放供电.1
USB_OUT: USB_M.1(VCC) 供电切换.5
USB_OUT_TO: 5824_2.1(A) 供电切换.4
wei1: 5R50.1 74HC573_2.16(4Q)
wei2: 6R50.1 74HC573_2.15(5Q)
ws2812: 74HC245.13(B5) WS2812.3(AC)
Net0.1uf-_2: 0.1uf-.2 555.8
Net0.1uf_,,_1: 0.1uf_,,.1 330R.2 DS1302.1
Net0.1uu,_1: 0.1uu,.1 0.4R.1 10uu，.1 TP4056.4(VCC) TP4056.8(CE)
Net0.8UF_2: 0.8UF.2 10k-,.1 10k-,,.2
Net0_1: 0.1(A) 1KR.2
Net1_1: 1.1(A) 1KR,.2
Net1k,_1: 1k,.1 signA-.1(A) signB-.1(A)
Net1K-,,,_2: 1K-,,,.2 P1.2/.2 SI2302-,.2(D)
Net1K-,_2: 1K-,.2 SI2302-,.1(G)
Net1K--,,,_2: 1K--,,,.2 P1.4/.2 SI2302--,.2(D)
Net1K--,_2: 1K--,.2 SI2302--,.1(G)
Net1K---,,,_2: 1K---,,,.2 P1.5/.2 SI2302---,.2(D)
Net1K---,_2: 1K---,.2 SI2302---,.1(G)
Net1K----,,,_2: 1K----,,,.2 P1.3/.2 SI2302----,.2(D)
Net1K----,_2: 1K----,.2 SI2302----,.1(G)
Net1k_1: 1k.1 led1.2(K) led2.2(K) led3.2(K) led4.2(K) led5.2(K) led6.2(K) led7.2(K) led8.2(K)
Net1k_,,_2: 1k_,,.2 充满.2(K)
Net1k_,.._1: 1k_,...1 red.1(A)
Net1k_,._2: 1k_,..2 充电.2(K)
Net1k_,_2: 1k_,.2 电池供电中.2(K)
Net1k_,ccw_2: 1k_,ccw.2 ccw_led.2(K)
Net1k_,cw_2: 1k_,cw.2 cw_led.2(K)
Net1k__2: 1k_.2 USB供电中.2(K)
Net1KK,_1: 1KK,.1 S8550..2(B)
Net1kk_2: 1kk.2 ttp1.1
Net1ko_2: 1ko.2 4.7uf.2
Net3.3K_1: 3.3K.1 PWM输出&接入滤波.1
Net3.3K_2: 3.3K.2 3.3K,.1 104-,..1
Net3k_2: 3k.2 TP4056.2(PROG)
Net4.7UH,_1: 4.7UH,.1 5824_0,.1(A) SX1308,.1
Net4.7UH_1: 4.7UH.1 5824_0.1(A) SX1308.1
Net4k_2: 4k.2 幅度调节.1
Net5R50_2: 5R50.2 SI2302_1.1(G)
Net6R50_2: 6R50.2 SI2302_2.1(G)
Net10k,,,_2: 10k,,,.2 10u,,.1 QNPN..2(B)
Net10k,,_2: 10k,,.2 10u,.1 QNPN.2(B)
Net10k,._1: 10k,..1 15P..1 73.2k.1 SX1308,.3
Net10k,_1: 10k,.1 10k,,.1 10k,,,.1 22UF,.2 B.1(A) G.1(A) light_SW.3 R..1(A)
Net10k,_2: 10k,.2 10u,,,,.1 NPNQ1.2(B)
Net10k_1: 10k.1 15P.1 90k.1 SX1308.3
Net10KR_1: 10KR.1 10UFF.2 300R.2 RSE.1
Net10nf_2: 10nf.2 15k.1
Net10R,_1: 10R,.1 LCD1602.15(BLA)
Net10R_1: 10R.1 红外发射管.1(A)
Net10R_2: 10R.2 S8550..3(C)
Net10u,,,,_2: 10u,,,,.2 100,,,.2 QNPN..1(C)
Net10u,,_2: 10u,,.2 100,,.2 QNPN.1(C)
Net10u,_2: 10u,.2 100,.2 NPNQ1.1(C)
Net15P._2: 15P..2 22UF-.2 73.2k.2 104--.2 5824_0,.2(K) Fuse_1A.1
Net30pf_1: 30pf.1 TOUCH.1 ttp1.3
Net32.768K_1: 32.768K.1(OSC1) DS1302.2
Net32.768K_2: 32.768K.2(OSC2) DS1302.3
Net47k_1_2: 47k_1.2 5819_3.1(A)
Net74HC00_1: 74HC00.1 74HC00.2 74HC00.6
Net74HC00_3: 74HC00.3 Q2.1(G) Q3.1(G)
Net74HC00_8: 74HC00.8 Q1.1(G) Q4.1(G)
Net74HC00_9: 74HC00.9 74HC00.10 74HC00.11
Net74HC04_2: 74HC04.2 速度失能1.1
Net74HC04_4: 74HC04.4 速度失能2.2
Net74HC14_2: 74HC14.2 74HC14.3
Net74HC14_4: 74HC14.4 74HC74.3(CLK) 74HC74.12(D) 74HC74.13(CD)
Net74HC14_6: 74HC14.6 74HC14.9
Net74HC14_8: 74HC14.8 74HC74.1(CD) 74HC74.2(D) 74HC74.11(CLK)
Net74HC595_1: 74HC595.1(QB) PACK220R_1.3
Net74HC595_2: 74HC595.2(QC) PACK220R_1.5
Net74HC595_3: 74HC595.3(QD) PACK220R_1.7
Net74HC595_4: 74HC595.4(QE) PACK220R_2.1
Net74HC595_5: 74HC595.5(QF) PACK220R_2.3
Net74HC595_6: 74HC595.6(QG) PACK220R_2.5
Net74HC595_7: 74HC595.7(QH) PACK220R_2.7
Net74HC595_15: 74HC595.15(QA) PACK220R_1.1
Net74HC595__1: 74HC595_.1(QB) led2.1(A)
Net74HC595__2: 74HC595_.2(QC) led3.1(A)
Net74HC595__3: 74HC595_.3(QD) led4.1(A)
Net74HC595__4: 74HC595_.4(QE) led5.1(A)
Net74HC595__5: 74HC595_.5(QF) led6.1(A)
Net74HC595__6: 74HC595_.6(QG) led7.1(A)
Net74HC595__7: 74HC595_.7(QH) led8.1(A)
Net74HC595__15: 74HC595_.15(QA) led1.1(A)
Net90k_2: 90k.2 100K-ADJ.1
Net100,,,_1: 100,,,.1 B.2(K)
Net100,,_1: 100,,.1 G.2(K)
Net100,_1: 100,.1 R..2(K)
Net120R,,,,,,_1: 120R,,,,,,.1 NRF24L01.8(IRQ)
Net120R,,,,,_1: 120R,,,,,.1 NRF24L01.7(MISO)
Net120R,,,,_1: 120R,,,,.1 NRF24L01.6(MOSI)
Net120R,,,_1: 120R,,,.1 NRF24L01.5(SCK)
Net120R,,_1: 120R,,.1 NRF24L01.4(CSN)
Net120R,_1: 120R,.1 NRF24L01.3(CE)
Net180_1: 180.1 S8550.2(B)
Net300R_1: 300R.1 硬件复位.2
Net5819_0_1: 5819_0.1(A) 5819_1.2(K)
Net5819_0_2: 5819_0.2(K) 5819_1.1(A)
Net5819_1: 5819.1(A) 下载口.1
Net5819_3_2: 5819_3.2(K) 占空比.1
Net5819_4_1: 5819_4.1(A) 占空比.3
Net5824_2_2: 5824_2.2(K) Fuse_0.5A.2
Net5824_3_1: 5824_3.1(A) BAT_3.7V.1 BAT_+.1
NetBEEP1_1: BEEP1.1(P) S8550.3(C)
NetCR1220_1: CR1220.1(+) DS1302.5
NetL9110_1_1: L9110_1.1 MOTO_1.2
NetL9110_1_4: L9110_1.4 MOTO_1.1
NetL9110_2_1: L9110_2.1 MOTO_2.2
NetL9110_2_4: L9110_2.4 MOTO_2.1
NetLCD1602_3: LCD1602.3(VEE) 对比度.2
NetLG5611AH_1_3: LG5611AH_1.3(cs) LG5611AH_1.8(cs) SI2302_1.2(D)
NetLG5611AH_2_3: LG5611AH_2.3(cs) LG5611AH_2.8(cs) SI2302_2.2(D)
NetTP4056_6: TP4056.6(~{STDBY}) 充满.1(A)
NetTP4056_7: TP4056.7(~{CHRG}) 充电.1(A)
Net占空比_2: 占空比.2 频率.3

Not connected (* = marked no-connect by the designer): 74HC74 5(Q)* 9(Q)*; 74HC245 11(B7); 74HC573_3 12(8Q)* 13(7Q)*; 74HC595_ 9(SDO)*; light_SW 1; PCF8591 14*; STC15F2K60S2 20(GND); SW-EC11 6* 7*; SX1308 4*; SX1308, 4*; USB_M 2(D-) 3(D+) 4(ID); WS2812 2(V+)*; 供电切换 1 6; 运放供电 3

### Notes on the sheet
- 包括减速电机（点击可以直接卡在板子上）、电池、MCU、
- 设计初心：板子本身就是小车的底盘，
- 红外发射+接收
- 温湿度
- 24L01（后）
- 模电部分
- Author：
- 收尾
- 研制
- 电源、各种模块（小车上用的以及其他）
- 长宽：10CM x 5CM
- USB 电源模块
- 露铜 板透明+灯饰
- LOGO
- OLED
- 1602
- 设计之初的模块：
- WS2812
- 布局示意图:
- 蓝牙+下载口
- STC15F2K60S2
- 数码管+LED
- 旋转编码器+解码电路
- 一路继电器
- 10X10（CM）
- 电机1接口
- 摇杆1
- 摇杆2
- 电机2接口
- ！小问题需要不断完善+参考其他开发板
- ！引脚分配挺烧脑，IO资源很紧张，而且总有更好的方案...
- 两路电机驱动（L1901）
- 红外对管
- 请大神帮查个错呗~
- 螺丝孔
- 蜂鸣器（后）
- 旋转编码器
- 矩阵按键+独立按键
- 电机驱动芯片+H桥（后）
- 触摸IC
- ！H桥和模数电部分（324/555）已经用0欧电阻隔地
- STC15F2K60S2（另预留STM32位置）
- 数码管（595+4017）
- 五向按键
- 真心的...
- ↓
- 辅助芯片和其他模块均在背面
- ！W25Q32的IO新用MOS电路做电平转换
- 555→I/O测频率、无缘蜂鸣器（也可选I/O驱动）
- DS1302/24C02
- 3.3V-5V双向电压转换电路
- ！供电有USB和单节锂电池供电，选择USB供电模式时，如果接入锂电池会自动充电
- ！SPI只能用前两个引脚分配，没有P4.0就没有SPI_3
- LM324 一路文氏桥，两路放大给单片机AD，
- LM393 话筒/光敏
- 选配：1602/OLED/蓝牙/24L01/8266
- 数字电路-74HC138
- 触摸按键TTP223
- 手焊成品估价：35（器件）+70/20（一块PCB板）=40RMB
- 分块布局，汉字标识，电容电阻大小标出
- 其中不包含18b20 DHT11 24L01 蓝牙模块和摇杆
- 鉴于资源紧张，没有给2003步进电机驱动模块、超声波模块、继电器模块等简单的模块留位置，可以用杜邦线外接这些模块
- 红外接收
- 红外发射
- P1.2/SS, P1.3/MOSI, P1.4/MISO, P1.5/SCLK
- SPI_1：
- W25Q32
- 两个595级联驱动数码管和LED
- DHT11&DS18B20
- NRF24L01
- LCD1602
- P2.4/SS_2, P2.3/MOSI_2, P2.2/MISO_2, P2.1/SCLK_2
- SPI_2：
- 串口2  P1.0/RxD2, P1.1/TxD2
- 蓝牙
- (near 蓝牙) V G T R
- 四MOS组成H桥+逻辑电路
- AO3400 H桥
- DS1302+备用电池
- 6按键矩阵键盘+3独立按键
- 蜂鸣器
- 下载口
- 一个IIC下的24C02和PCF8591
- 记得把引脚配置为推挽
- 串口1  P3.0/RxD, P3.1/TxD
- (near 下载口) V G T R
- PCA-PWM当DAC用
- (near KEY10) INT0 INT1
- 反接的四个二极管已经去除
- (near 4.7UH,) 一节锂电池外部电源供电稳压
- 读
- 这里电源滤波电容 0.1 22 去掉了
- (near 300R.) 摇杆X1（带按键）
- (near BAT_-) 电池焊盘
- д
- 74HC245:8路双向3态缓冲芯片（573是单向的带锁存的）
- 摁下电池供电，可用大电流设备
- 弹起USB供电（有电池就给电池充电）
- (near 供电切换) 有USB供电时，不能用大电流设备！！
- L9110 电机正反转 X2
- (near JoyStick_1) INT0 INT1
- 连接单片机IO
- SX1308
- 一节锂电池充电电路
- (near WS2812) 单线控制三色灯
- 触摸开关IC
- 升压给324/555
- SW
- NC
- 注：标这种棕绿色是有跳线帽或者锁存器的，可以选择当自由引脚
- I/O分配
- GND
- FB
- IN
- (near 4.7UH) EN
- 漂亮交替闪，灯呈圆形排列，中间放LOGO。
- 首先，没有空闲引脚，正好配完，除非拔取某些跳线帽
- USB电源口
- P0：6按键矩阵键盘；OLED；74HC245和573的输入端，把芯片失能后，P0口解放
- P1：蓝牙模块→串口2  P1.0/RxD2, P1.1/TxD2，被占用时也可以插到下载口上
- VIN-12V 2A_MAX
- 555 幅度 频率 占空比可调
- W25Q32→SPI_1:P1.2/SS, P1.3/MOSI, P1.4/MISO, P1.5/SCLK
- 1602→ P1.2/RS,P1.3/RW,P1.4/E
- DHT11和DS18B20共用的单线通讯线→P1.5
- 摇杆→ 摇杆1:P1.0,P1.1;（摇杆2:P1.6,P1.7已经去掉）。用其ADC功能
- P2：24L01模块接口→SPI_2：P2.4/SS_2, P2.3/MOSI_2, P2.2/MISO_2, P2.1/SCLK_2
- LM324
- 两个用来产生正弦 一个积分一个放大
- P2.0/CE,P2.5/IRQ
- 模拟IIC（ds1302,24c02,pcf8591）→P2.6/SDA,P2.7/SCL
- P3: 串口1（下载口）→P3.0/RxD, P3.1/TxD
- 独立按键、旋转编码器解码输出、摇杆按键→P3.2/（外部中断0），P3.3/（外部中断1）
- DS1302→P3.4/RST
- PWM输出到滤波当DAC使用→P3.5
- 旋转编码器 解码电路
- 第三片573的5、6输入端上，P3.6\P3.7可以输出PWM，控制两路L9110驱动两个小电机
- INT0 INT1
- P4: P4.1/245的使能,P4.2/245的方向,P4.4/573_1的锁存,P4.5/573_2的锁存
- P5: P5.5/573_3的锁存
- (near 0.96`OLED) oled
- 3.3V稳压
- 1/1
- Labels drawn without touching a wire or pin: V5
- (in symbol LG5611AH) DPY; dp

### Library data of the parts
0 1 B ccw_led cw_led G led1-led8 R. red signA- signB- USB供电中 充满 充电 电池供电中 红外发射管 = LED0: 发光二极管; Published: 8-Jun-2000; LatestRevisionDate: 08-Jul-2005; LatestRevisionNote: Mech Layer 1 removed.; PackageReference: LED-0; Publisher: Altium Limited
0.1u 0.1u, 0.1u,, 0.1u,,, 0.1u,,. 0.1u,. 0.1UF, 0.1uf- 0.1uf_, 0.1uf_,, 0.1uf_,,, 0.1uu 0.1uu, 0.3UF 0.8UF 1uf 4.7uf 10nf 10nf_ 10u, 10u,, 10u,,,, 10u-, 10uu 10uu， 15P 15P. 22U 22u, 22uf 22UF, 22UF- 22UF-. 104, 104,, 104,,- 104-- 104_- = Cap: Capacitor; Value: 0.1uF; Published: 8-Jun-2000; LatestRevisionDate: 17-Jul-2002; LatestRevisionNote: Re-released for DXP Platform.; PackageReference: RAD-0.3; Publisher: Altium Limited; PackageDescription: Radial Cap, Thru-Hole; 2 Leads; 0.3 in Pin Spacing
0.1UF,-, 10UFF 22u_1 22UF,- 104-,, 104-,. = C？
0.4R 0R, 0R,, 0R,,, 0R,,,, 0r_1-0r_4 1k, 1k_ 1k_3 1k_, 1k_,, 1k_,. 1k_,ccw 1k_,cw 1kk 1ko 3k 4.7K. 4k 10k 10k, 10k,, 10k,,, 10k,. 10K- 10k-, 10k-,, 10K-- 10k--, 10k_2 10k_3 10kk, 14K 15k 15k_ 47k_0 47k_1 73.2k 90k 100, 100,, 100,,, = Res2: Resistor; Value: 10K; Published: 8-Jun-2000; LatestRevisionDate: 17-Jul-2002; LatestRevisionNote: Re-released for DXP Platform.; PackageReference: AXIAL-0.4; Publisher: Altium Limited; PackageDescription: Axial Device, Thru-Hole; 2 Leads; 0.4 in Pin Spacing
1k 4.7K, 120R, 120R,, 120R,,, 120R,,,, 120R,,,,, 120R,,,,,, = Res1: 贴片电阻; Value: 100; Published: 8-Jun-2000; LatestRevisionDate: 17-Jul-2002; LatestRevisionNote: Re-released for DXP Platform.; PackageReference: AXIAL-0.4; Publisher: Altium Limited
1K-, 1K-,, 1K-,,, 1K--, 1K--,, 1K--,,, 1K---, 1K---,, 1K---,,, 1K----, 1K----,, 1K----,,, 1KK, 1KR 1KR, 4.7K 10kk. 10kk.. 10KR 10R 10R, 180 300R 300R. = Res2: Resistor; Value: 180; Published: 8-Jun-2000; LatestRevisionDate: 17-Jul-2002; LatestRevisionNote: Re-released for DXP Platform.; PackageReference: AXIAL-0.4; Publisher: Altium Limited; PackageDescription: Axial Device, Thru-Hole; 2 Leads; 0.4 in Pin Spacing
1k_,.. 5R50 6R50 10K-,- 10K_,, 10K_,,, 10K_,,- 10K_,,. 330R = Res2: Resistor; Value: 4.7R; Published: 8-Jun-2000; LatestRevisionDate: 17-Jul-2002; LatestRevisionNote: Re-released for DXP Platform.; PackageReference: AXIAL-0.4; Publisher: Altium Limited
3.3K 3.3K, = Res2: Resistor; Published: 8-Jun-2000; LatestRevisionDate: 17-Jul-2002; LatestRevisionNote: Re-released for DXP Platform.; PackageReference: AXIAL-0.4; Publisher: Altium Limited; PackageDescription: Axial Device, Thru-Hole; 2 Leads; 0.4 in Pin Spacing
4.7UH 4.7UH, = Inductor: 电感; Code_IEC: 1005; Value: 10uH; Published: 8-Jun-2000; LatestRevisionDate: 17-Jul-2002; LatestRevisionNote: Re-released for DXP Platform.; PackageReference: 0402-A; Publisher: Altium Limited; Code_JEITA: 0402
10K-ADJ 100K-ADJ light_SW 占空比 对比度 幅度 幅度调节 积分增益调节 运放供电 运放增益调节 频率 = MHDR1X3: Header, 3-Pin; LatestRevisionDate: 17-Jul-2002; LatestRevisionNote: Re-released for DXP Platform.; Publisher: Altium Limited
22U. 22U; 47U, = Cap Pol1: Polarized Capacitor (Radial); Value: 22; Published: 8-Jun-2000; LatestRevisionDate: 17-Jul-2002; LatestRevisionNote: Re-released for DXP Platform.; PackageReference: RB7.6-15; Publisher: Altium Limited; PackageDescription: Polarized Capacitor (Radial); 2 Leads
30pf = Cap: Capacitor; Published: 8-Jun-2000; LatestRevisionDate: 17-Jul-2002; LatestRevisionNote: Re-released for DXP Platform.; PackageReference: RAD-0.3; Publisher: Altium Limited; PackageDescription: Radial Cap, Thru-Hole; 2 Leads; 0.3 in Pin Spacing
32.768K = XTAL_1: Crystal Oscillator; Published: 8-Jun-2000; LatestRevisionDate: 17-Jul-2002; LatestRevisionNote: Re-released for DXP Platform.; Publisher: Altium Limited
74HC595 74HC595_ = 74HC595: 移位寄存器; ComponentAvailability: Not for New Design; Published: 15-Apr-2002; LatestRevisionDate: 13-Apr-2006; LatestRevisionNote: IPC-7351 Footprint Added.; DatasheetVersion: 1997; PackageVersion: 1997; PackageReference: 966-01; Publisher: Altium Limited; PackageDescription: 16-Pin Small Outline Package 1.27 mm Pitch; ComponentLink1Description: Manufacturer Link; ComponentLink1URL: http://www.onsemi.com/; ComponentLink2Description: Datasheet; ComponentLink2URL: http://www.onsemi.com/pub/Collateral/MC74VHC595-D.PDF
104 104,. 104-, 104-,- 104-,-- = Cap: Capacitor; Value: 100pF; Published: 8-Jun-2000; LatestRevisionDate: 17-Jul-2002; LatestRevisionNote: Re-released for DXP Platform.; PackageReference: RAD-0.3; Publisher: Altium Limited; PackageDescription: Radial Cap, Thru-Hole; 2 Leads; 0.3 in Pin Spacing
220UF_ 220UF_- 1000UF = Cap Pol1: Polarized Capacitor (Radial); Value: 10uF; Published: 8-Jun-2000; LatestRevisionDate: 17-Jul-2002; LatestRevisionNote: Re-released for DXP Platform.; PackageReference: RB7.6-15; Publisher: Altium Limited; PackageDescription: Polarized Capacitor (Radial); 2 Leads
555 DS1302 L9110_1 L9110_2 = Header 4X2A: Header, 4-Pin, Dual row; pin to pad: 5>8 6>7 7>6 8>5; LatestRevisionDate: 17-Jul-2002; LatestRevisionNote: Re-released for DXP Platform.; Publisher: Altium Limited
555方波信号->运放3 H桥_OUT MOTO_1 MOTO_2 升压输出 正弦输出 = Header 2: Header, 2-Pin; LatestRevisionDate: 17-Jul-2002; LatestRevisionNote: Re-released for DXP Platform.; Publisher: Altium Limited
1117-3.3 = Component_1
5819 5819, 5819_0 5819_1 5819_3 5819_4 5824_0 5824_0, 5824_2 5824_3 = Diode 1N4001: 1 Amp General Purpose Rectifier; Published: 8-Jun-2000; LatestRevisionDate: 17-Jul-2002; LatestRevisionNote: Re-released for DXP Platform.; DatasheetDocument: 1998; PackageDocument: Aug-1999; PackageReference: DO-41; Publisher: Altium Limited; Code_JEDEC: DO-204-AL; ComponentLink1Description: Manufacturer Link; ComponentLink1URL: http://www.fairchildsemi.com/; ComponentLink2Description: Datasheet; ComponentLink2URL: http://www.fairchildsemi.com/ds/1N%2F1N4001.pdf
AD/DA = Header 5: Header, 5-Pin; LatestRevisionDate: 17-Jul-2002; LatestRevisionNote: Re-released for DXP Platform.; Publisher: Altium Limited
AT24C02 = AT24C02: EEROM存储器
BAT_3.7V P1.2/ P1.3/ P1.4/ P1.5/ P3.5滤波输出 PWM输出&接入滤波 光敏电阻 硬件复位 速度失能1 速度失能2 = Header 2: 接插件; LatestRevisionDate: 17-Jul-2002; LatestRevisionNote: Re-released for DXP Platform.; Publisher: Altium Limited
CR1220 = Battery: Multicell Battery; Published: 24-Mar-1999; LatestRevisionDate: 17-Jul-2002; LatestRevisionNote: Re-released for DXP Platform.; PackageReference: BAT-2; Publisher: Altium Limited; PackageDescription: Battery; 2 Leads
DHT11&DS18B20 = DHT11: 数字温湿度传感器
Fuse_0.5A Fuse_1A = Fuse 2: 保险丝; Value: 1A; Published: 8-Jun-2000; LatestRevisionDate: 17-Jul-2002; LatestRevisionNote: Re-released for DXP Platform.; PackageReference: PIN-W2/E2.8; Publisher: Altium Limited
Fuse_3A = Fuse 2: 保险丝; Value: 3A; Published: 8-Jun-2000; LatestRevisionDate: 17-Jul-2002; LatestRevisionNote: Re-released for DXP Platform.; PackageReference: PIN-W2/E2.8; Publisher: Altium Limited
IR_ 积分、放大输入 积分、放大输出 输出波形 = Header 3: Header, 3-Pin; LatestRevisionDate: 17-Jul-2002; LatestRevisionNote: Re-released for DXP Platform.; Publisher: Altium Limited
JoyStick_1 = JoyStick: 模拟摇杆
KEY1-KEY10 RSE = SW-PB: 微动开关; Published: 24-Mar-1999; LatestRevisionDate: 17-Jul-2002; LatestRevisionNote: Re-released for DXP Platform.; PackageReference: SPST-2; Publisher: Altium Limited
NPNQ1 QNPN QNPN. = QNPN: NPN Bipolar Transistor; Published: 8-Jun-2000; LatestRevisionDate: 29-May-2009; LatestRevisionNote: IPC-7351 Footprint Added.; PackageVersion: Aug-1999; PackageReference: SOT-23B; Publisher: Altium Limited; PackageDescription: 3-Pin SOT-23 Package 0.95 mm Pitch, 2.4 mm Lead Span
PCF8591 = Header 8X2A: Header, 8-Pin, Dual row; pin to pad: 9>16 10>15 11>14 12>13 13>12 14>11 15>10 16>9; LatestRevisionDate: 17-Jul-2002; LatestRevisionNote: Re-released for DXP Platform.; Publisher: Altium Limited
Q1-Q4 SI2302-, SI2302--, SI2302---, SI2302----, SI2302_1 SI2302_2 = NMOS-2: N-Channel Power MOSFET; Note: Pin 2 is electrically connected to pin 4.; Published: 8-Jun-2000; LatestRevisionDate: 17-Jul-2002; LatestRevisionNote: Re-released for DXP Platform.; DatasheetDocument: PD-9.814; PackageReference: TO-220AB; Publisher: Altium Limited; Code_JEDEC: TO-220-AB; ComponentLink1Description: Manufacturer Link; ComponentLink1URL: http://www.irf.com/
S8550 S8550. = PNP: 8550/BCW68
SW-EC11 = SW-EC11: 旋转编码开关; Published: 24-Mar-1999; LatestRevisionDate: 17-Jul-2002; LatestRevisionNote: Re-released for DXP Platform.; PackageReference: SPST-2; Publisher: Altium Limited
SX1308 SX1308, = Header 3X2A: Header, 3-Pin, Dual row; pin to pad: 4>6 6>4; LatestRevisionDate: 17-Jul-2002; LatestRevisionNote: Re-released for DXP Platform.; Publisher: Altium Limited
TP4056 = TP4056: 锂电池充电管理
ttp1 = Header 3X2: Header, 3-Pin, Dual row; LatestRevisionDate: 17-Jul-2002; LatestRevisionNote: Re-released for DXP Platform.; Publisher: Altium Limited
USB_M = USB_M: MicroUSB接口
W25Q32 = W25X16: W25X16;SST25VF016;MX25L1605
WS2812 = BRIDGE2: Diode Bridge; pin to pad: 3>4 4>3
下载口 蓝牙 = Header 4: Header, 4-Pin; LatestRevisionDate: 17-Jul-2002; LatestRevisionNote: Re-released for DXP Platform.; Publisher: Altium Limited
供电切换 = SW-DPDT: 单刀双掷开关; Published: 24-Mar-1999; LatestRevisionDate: 17-Jul-2002; LatestRevisionNote: Re-released for DXP Platform.; PackageReference: DPDT-6; Publisher: Altium Limited